# Altium schematic sheet batt.SchDoc: Battery Protection
size A4; DrawnBy: J. Reimer T. Yeung M. Hirole; Organization: UTAT SS; DocumentNumber: 4; Revision: 2.0; SheetNumber: 4; SheetTotal: 17
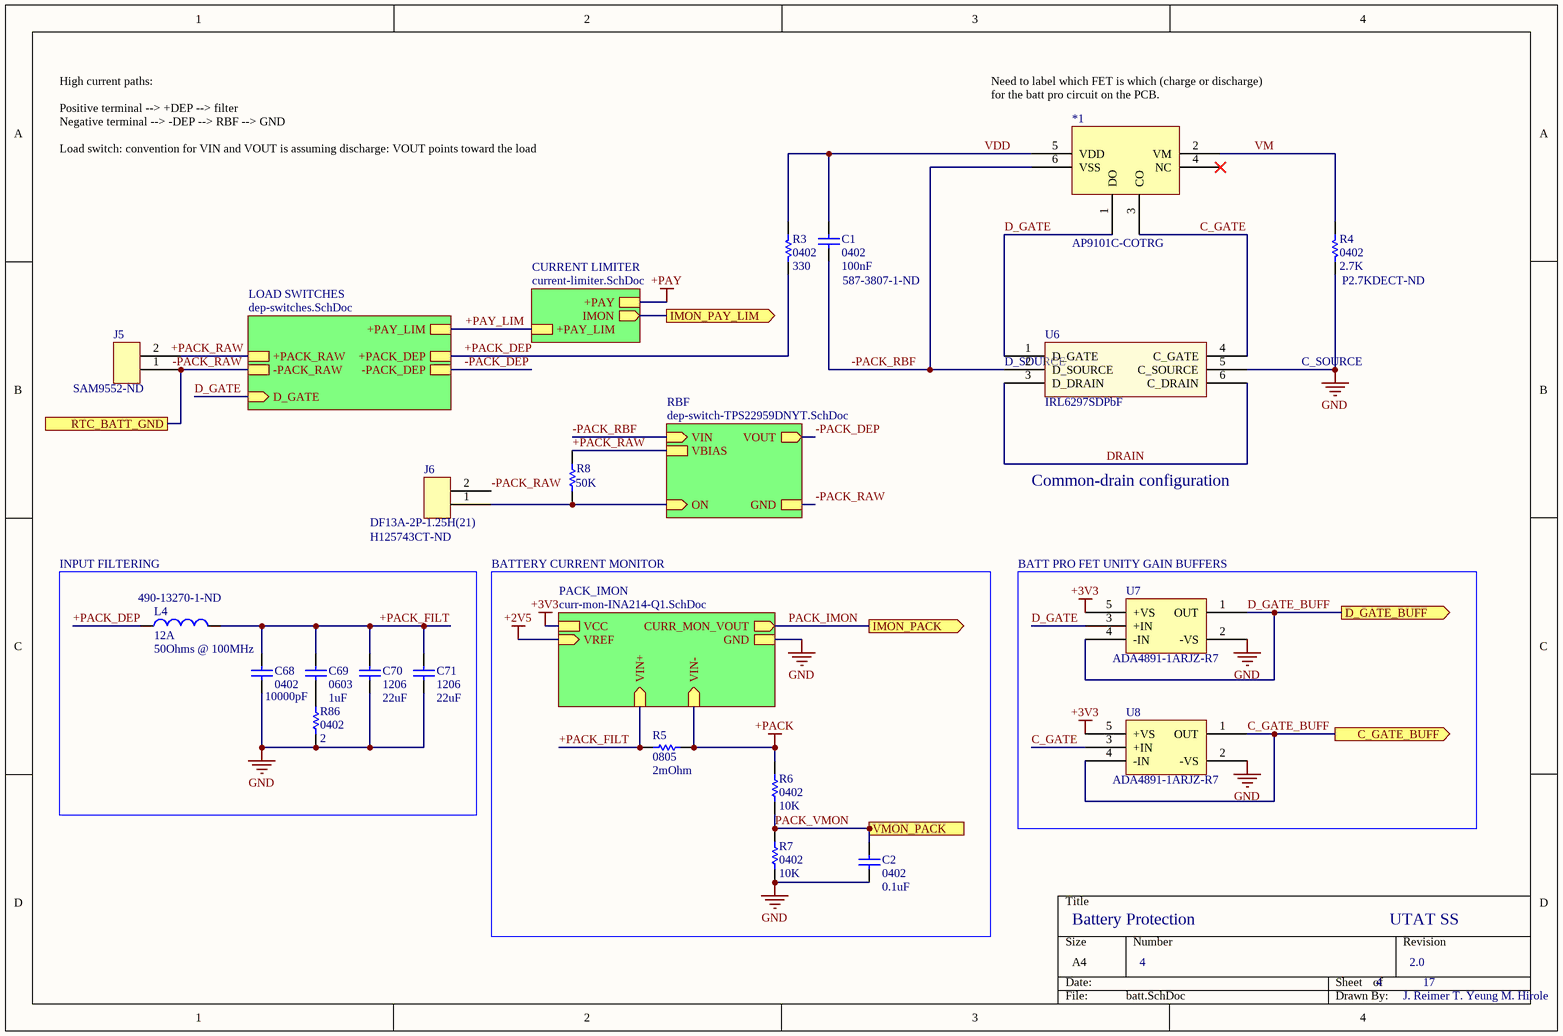
[diagram p0: batt.SchDoc]

## Parts
*1  AP9101C-COTRG  [SOT-26]
C1  0402  value 100nF  Supplier Part Number 1: 587-3807-1-ND  [CAP0402R]
C2  0402  value 0.1uF  [CAP0402R]
C68  0402  value 10000pF  [CAP0402R]
C69  0603  value 1uF  [CAP0603R]
C70  1206  value 22uF  [CAP1206R]
C71  1206  value 22uF  [CAP1206R]
J5  IPBT-102-H1-T-S-RA-K  [SAM9552-ND]  (value not drawn)
J6  DF13A-2P-1.25H(21)  Supplier Part Number 1: H125743CT-ND  [DF13A-2P-1.25H(21)]
L4  12A  value 50Ohms @ 100MHz  Supplier Part Number 3: 490-13270-1-ND  [CAP1206R]
R3  0402  value 330  [RES0402R]
R4  0402  value 2.7K  Supplier Part Number 1: P2.7KDECT-ND  [RES0402R]
R5  0805  value 2mOhm  [RES0805R]
R6  0402  value 10K  [RES0402R]
R7  0402  value 10K  [RES0402R]
R8  value 50K  [RES0402R]  (hidden comment: 0402)
R86  0402  value 2  [RES0402R]
U6  IRL6297SDPbF  [IRL6297SDPbF]
U7  ADA4891-1ARJZ-R7  [SOT-23-5]
U8  ADA4891-1ARJZ-R7  [SOT-23-5]

## Blocks framed on the sheet
INPUT FILTERING: C68-C71 L4 R86
BATTERY CURRENT MONITOR: C2 R5-R7
BATT PRO FET UNITY GAIN BUFFERS: U7 U8

## Sub-sheets
CURRENT LIMITER = current-limiter.SchDoc: +PAY_LIM, +PAY, IMON (out)
LOAD SWITCHES = dep-switches.SchDoc: +PACK_RAW, D_GATE (in), +PAY_LIM, -PACK_RAW, -PACK_DEP, +PACK_DEP
PACK_IMON = curr-mon-INA214-Q1.SchDoc: VREF (in), VIN+ (in), VCC, GND, VIN- (in), CURR_MON_VOUT (out)
RBF = dep-switch-TPS22959DNYT.SchDoc: VIN (in), VOUT (out), GND, VBIAS, ON (in)

## Ports
C_GATE_BUFF (out), D_GATE_BUFF (out), IMON_PACK (out), IMON_PAY_LIM (out), RTC_BATT_GND, VMON_PACK (out)

## Nets
+2V5: sheet PACK_IMON/VREF
+3V3: U7.5(+VS) U8.5(+VS) ; sheet PACK_IMON/VCC
+PACK: R5.2 R6.2 ; sheet PACK_IMON/VIN-
+PAY: sheet CURRENT LIMITER/+PAY
GND: C2.1 C68.1 C70.1 C71.1 R4.1 R7.1 R86.1 U6.5(C_SOURCE) U7.2(-VS) U8.2(-VS) ; sheet PACK_IMON/GND
+PACK_DEP: L4.1 R3.2 ; sheet LOAD SWITCHES/+PACK_DEP
+PACK_FILT: C68.2 C69.2 C70.2 C71.2 L4.2 R5.1 ; sheet PACK_IMON/VIN+
+PACK_RAW: J5.2 R8.2 ; sheet LOAD SWITCHES/+PACK_RAW, sheet RBF/VBIAS
+PAY_LIM: sheet LOAD SWITCHES/+PAY_LIM, sheet CURRENT LIMITER/+PAY_LIM
-PACK_DEP: sheet LOAD SWITCHES/-PACK_DEP, sheet RBF/VOUT
-PACK_RAW: J5.1 J6.2 ; port RTC_BATT_GND, sheet LOAD SWITCHES/-PACK_RAW, sheet RBF/GND
-PACK_RBF: *1.6(VSS) C1.1 U6.2(D_SOURCE) ; sheet RBF/VIN
C_GATE: *1.3(CO) U6.4(C_GATE) U8.3(+IN)
C_GATE_BUFF: U8.1(OUT) U8.4(-IN) ; port C_GATE_BUFF
D_GATE: *1.1(DO) U6.1(D_GATE) U7.3(+IN) ; sheet LOAD SWITCHES/D_GATE
D_GATE_BUFF: U7.1(OUT) U7.4(-IN) ; port D_GATE_BUFF
DRAIN: U6.3(D_DRAIN) U6.6(C_DRAIN)
IMON_PAY_LIM: port IMON_PAY_LIM, sheet CURRENT LIMITER/IMON
PACK_IMON: port IMON_PACK, sheet PACK_IMON/CURR_MON_VOUT
PACK_VMON: C2.2 R6.1 R7.2 ; port VMON_PACK
VDD: *1.5(VDD) C1.2 R3.1
VM: *1.2(VM) R4.2
NetC69_1: C69.1 R86.2
NetJ6_1: J6.1 R8.1 ; sheet RBF/ON

Not connected (* = marked no-connect by the designer): *1 4(NC)*

## Notes on the sheet
- (near *1) Need to label which FET is which (charge or discharge) for the batt pro circuit on the PCB.
- High current paths:
  Positive terminal --> +DEP --> filter
  Negative terminal --> -DEP --> RBF --> GND
  Load switch: convention for VIN and VOUT is assuming discharge: VOUT points toward the load
- (near U6) D_SOURCE
- (near U6) C_SOURCE
- Common-drain configuration

## Library data of the parts
*1 = AP9101C-COTRG: Battery Protection IC
C1 = CAP0402: 0402 capacitor; Manufacturer: Taiyo Yuden; Manufacturer Part Number: EMK105B7104KVHF; Voltage Rating: 16V; Tolerance: 10%; Dielectric: X7R; Supplier 1: Digi-Key; Stock 1: 97505; Pricing 1: 1=0.1, 10=0.052, 100=0.0233, 500=0.01666, 1000=0.01309, 2500=0.0119, 5000=0.01095 (USD); Mount: Surface Mount; Case/Package: 0402; Weight: 2.3E-05oz; Case Code (Metric): 1005; Case Code (Imperial): 0402; Min Operating Temperature: -55°C; Max Operating Temperature: 125°C; Capacitance: 100nF; Package Quantity: 10000; Packaging: Tape and Reel; Termination: SMD/SMT; Voltage Rating (DC): 16V; Length: 0.039inch; Height: 0.5mm; Width: 0.02inch; Thickness: 0.022inch; Ratings: AEC-Q200; Lead Free: Lead Free; Halogen Free: Halogen Free; ComponentLink1URL: http://www.yuden.co.jp/ut/product/category/capacitor/putpdf/EMK105B7104KVHF_SS.pdf?src-supplier=Avnet; ComponentLink1Description: http://www.yuden.co.jp/ut/product/category/capacitor/putpdf/EMK105B7104KVHF_SS.pdf?src-supplier=Avnet; ComponentLink2URL: http://ds.yuden.co.jp/TYCOMPAS/ut/detail.do?productNo=EMK105B7104KVHF&fileName=EMK105B7104KVHF_SS&mode=specSheetDownload&src-supplier=Digi-Key; ComponentLink2Description: http://ds.yuden.co.jp/TYCOMPAS/ut/detail.do?productNo=EMK105B7104KVHF&fileName=EMK105B7104KVHF_SS&mode=specSheetDownload&src-supplier=Digi-Key; ComponentLink3URL: https://www.yuden.co.jp/productdata/catalog/mlcc01_hq_e.pdf?src-supplier=Digi-Key; ComponentLink3Description: https://www.yuden.co.jp/productdata/catalog/mlcc01_hq_e.pdf?src-supplier=Digi-Key; ComponentLink4URL: http://www.mouser.com/ds/2/396/mlcc11_hq_e-541564.pdf?src-supplier=Mouser; ComponentLink4Description: http://www.mouser.com/ds/2/396/mlcc11_hq_e-541564.pdf?src-supplier=Mouser
C2 = CAP0402: 0402 capacitor
C68 C69 = Cap: Capacitor; Published: 8-Jun-2000; LatestRevisionDate: 17-Jul-2002; LatestRevisionNote: Re-released for DXP Platform.; PackageReference: RAD-0.3; Publisher: Altium Limited; PackageDescription: Radial Cap, Thru-Hole; 2 Leads; 0.3 in Pin Spacing
C70 C71 = CAP1206: 1206 capacitor
J5 = IPBT-102-H1-T-S-RA-K: Samtec Connector Through Hole, Right Angle 2 pos 0.165" (4.20mm) pitch; Supplier 1: Digi-Key; Supplier Part Number 1: SAM9552-ND
J6 = DF13A-2P-1.25H(21): 2 pos DF13 right angle surface mount connector; Supplier 1: Digi-Key
L4 = Inductor: Inductor 50Ohms @ 100MHz; Code_IEC: 1005; Published: 8-Jun-2000; LatestRevisionDate: 29-May-2009; LatestRevisionNote: IPC-7351 Footprint Added.; PackageReference: 0402-A; Publisher: Altium Limited; PackageDescription: Chip Inductor; Code_JEITA: 0402; Supplier 1: Digi-Key; Supplier 2: Digi-Key; Supplier 3: Digi-Key
R3 R6-R8 = RES0402: 0402 resistor
  R3: Supplier 1: Digi-Key; Supplier Part Number 1: 541-330XDKR-ND
R4 = RES0402: 0402 resistor; Manufacturer: Panasonic; Manufacturer Part Number: ERA-2AED272X; Resistance: 2.7kR; Tolerance: 0.5%; Power Rating: 63mW; Voltage Rating: 25V; Temperature Coefficient: 25ppm/°C; Supplier 1: Digi-Key; Stock 1: 37826; Pricing 1: 1=0.22, 10=0.188, 100=0.0735, 1000=0.03077, 2500=0.0282, 5000=0.02564 (USD); Mount: Surface Mount; Case/Package: 0402; Case Code (Metric): 1005; Case Code (Imperial): 0402; Contact Plating: Tin; Min Operating Temperature: -55°C; Max Operating Temperature: 155°C; Packaging: Tape and Reel; Package Quantity: 1; Composition: Thin Film,Metal Film; Number of Terminations: 2; Max Power Dissipation: 63mW; Voltage Rating (DC): 25V; Features: Automotive AEC-Q200; Length: 0.039inch; Height: 0.016inch; Width: 0.02inch; REACH SVHC: No SVHC; Lead Free: Lead Free; ComponentLink1URL: http://www.farnell.com/datasheets/2059650.pdf?src-supplier=Element14; ComponentLink1Description: http://www.farnell.com/datasheets/2059650.pdf?src-supplier=Element14
R5 = RES0805: 0805 resistor; Manufacturer: Panasonic; Manufacturer Part Number: ERJ-8BWJR010V; Resistance: 10mR; Power Rating: 1W; Tolerance: 5%; Temperature Coefficient: 200ppm/°C; Supplier 1: Digi-Key; Supplier Part Number 1: P.010AVDKR-ND; Stock 1: 70650; Pricing 1: 1=0.68, 10=0.5, 100=0.2911, 1000=0.16327, 2500=0.15763 (USD); Mount: Surface Mount; Case/Package: 1206; Case Code (Imperial): 1206; Case Code (Metric): 3216; Contact Plating: Tin; Min Operating Temperature: -55°C; Max Operating Temperature: 155°C; Packaging: Tape and Reel; Package Quantity: 1; Termination: SMD/SMT; Composition: Thick Film; Number of Terminations: 2; Military Standard: Not; Max Power Dissipation: 1W; Features: Automotive AEC-Q200; Length: 3.2mm; Height: 0.65mm; Width: 1.6mm; Depth: 1.6mm; Radiation Hardening: No; Lead Free: Lead Free; ComponentLink1URL: http://industrial.panasonic.com/www-data/pdf/AOA0000/AOA0000CE3.pdf?src-supplier=Avnet; ComponentLink1Description: http://industrial.panasonic.com/www-data/pdf/AOA0000/AOA0000CE3.pdf?src-supplier=Avnet; ComponentLink2URL: https://industrial.panasonic.com/cdbs/www-data/pdf/RDN0000/AOA0000C313.pdf?src-supplier=Digi-Key; ComponentLink2Description: https://industrial.panasonic.com/cdbs/www-data/pdf/RDN0000/AOA0000C313.pdf?src-supplier=Digi-Key; ComponentLink3URL: http://uk.rs-online.com/webdocs/13b8/0900766b813b869e.pdf?src-supplier=RSComponents; ComponentLink3Description: http://uk.rs-online.com/webdocs/13b8/0900766b813b869e.pdf?src-supplier=RSComponents
R86 = Res1: Resistor; Published: 8-Jun-2000; LatestRevisionDate: 17-Jul-2002; LatestRevisionNote: Re-released for DXP Platform.; PackageReference: AXIAL-0.3; Publisher: Altium Limited; PackageDescription: Axial Device, Thru-Hole; 2 Leads; 0.3 in Pin Spacing
U7 U8 = ADA4891-1ARJZ-R7: Rail-to-rail amplifier 125mA max; Vendor: Analog Devices Inc; Built_By: EMA_UL_Team; Manufacturer_Part_Number: ADA4891-1ARJZ-R7; Copyright: Copyright (C) 2018 Accelerated Designs. All rights reserved; RefDes: RefDes; Type: DEV; Value: Value; Supplier 1: Digi-Key; Supplier Part Number 1: ADA4891-1ARJZ-R7CT-ND
U6 = IRL6297SDPbF: Supplier 1: Digi-Key; Supplier Part Number 1: IRL6297SDTRPBF-ND